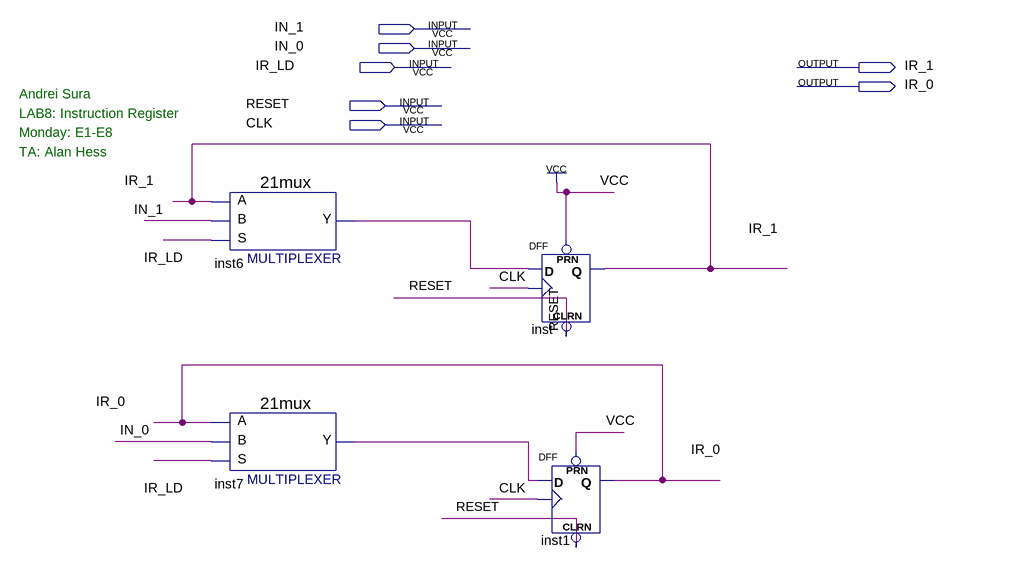
[diagram p0: schematic sheet]
// Quartus schematic instruction_register.bdf as structural Verilog: 4 symbols, 7 pins
module instruction_register (
  input  IN_1,
  input  IN_0,
  input  IR_LD,
  input  RESET,
  input  CLK,
  output IR_1,
  output IR_0
);

  wire inst6_y, inst7_y;

  \21mux  inst6 (.S(IR_LD), .B(IN_1), .A(IR_1), .Y(inst6_y));
  \21mux  inst7 (.S(IR_LD), .B(IN_0), .A(IR_0), .Y(inst7_y));
  DFF inst (.CLRN(RESET), .CLK(CLK), .D(inst6_y), .PRN(1'b1), .Q(IR_1));
  DFF inst1 (.CLRN(RESET), .CLK(CLK), .D(inst7_y), .PRN(1'b1), .Q(IR_0));

  // Notes on the sheet:
  //   Andrei Sura
  //   LAB8: Instruction Register
  //   Monday: E1-E8
  //   TA: Alan Hess
endmodule
